# EAGLE schematic FioSaber Prototype C (EAGLE 6.5.0)
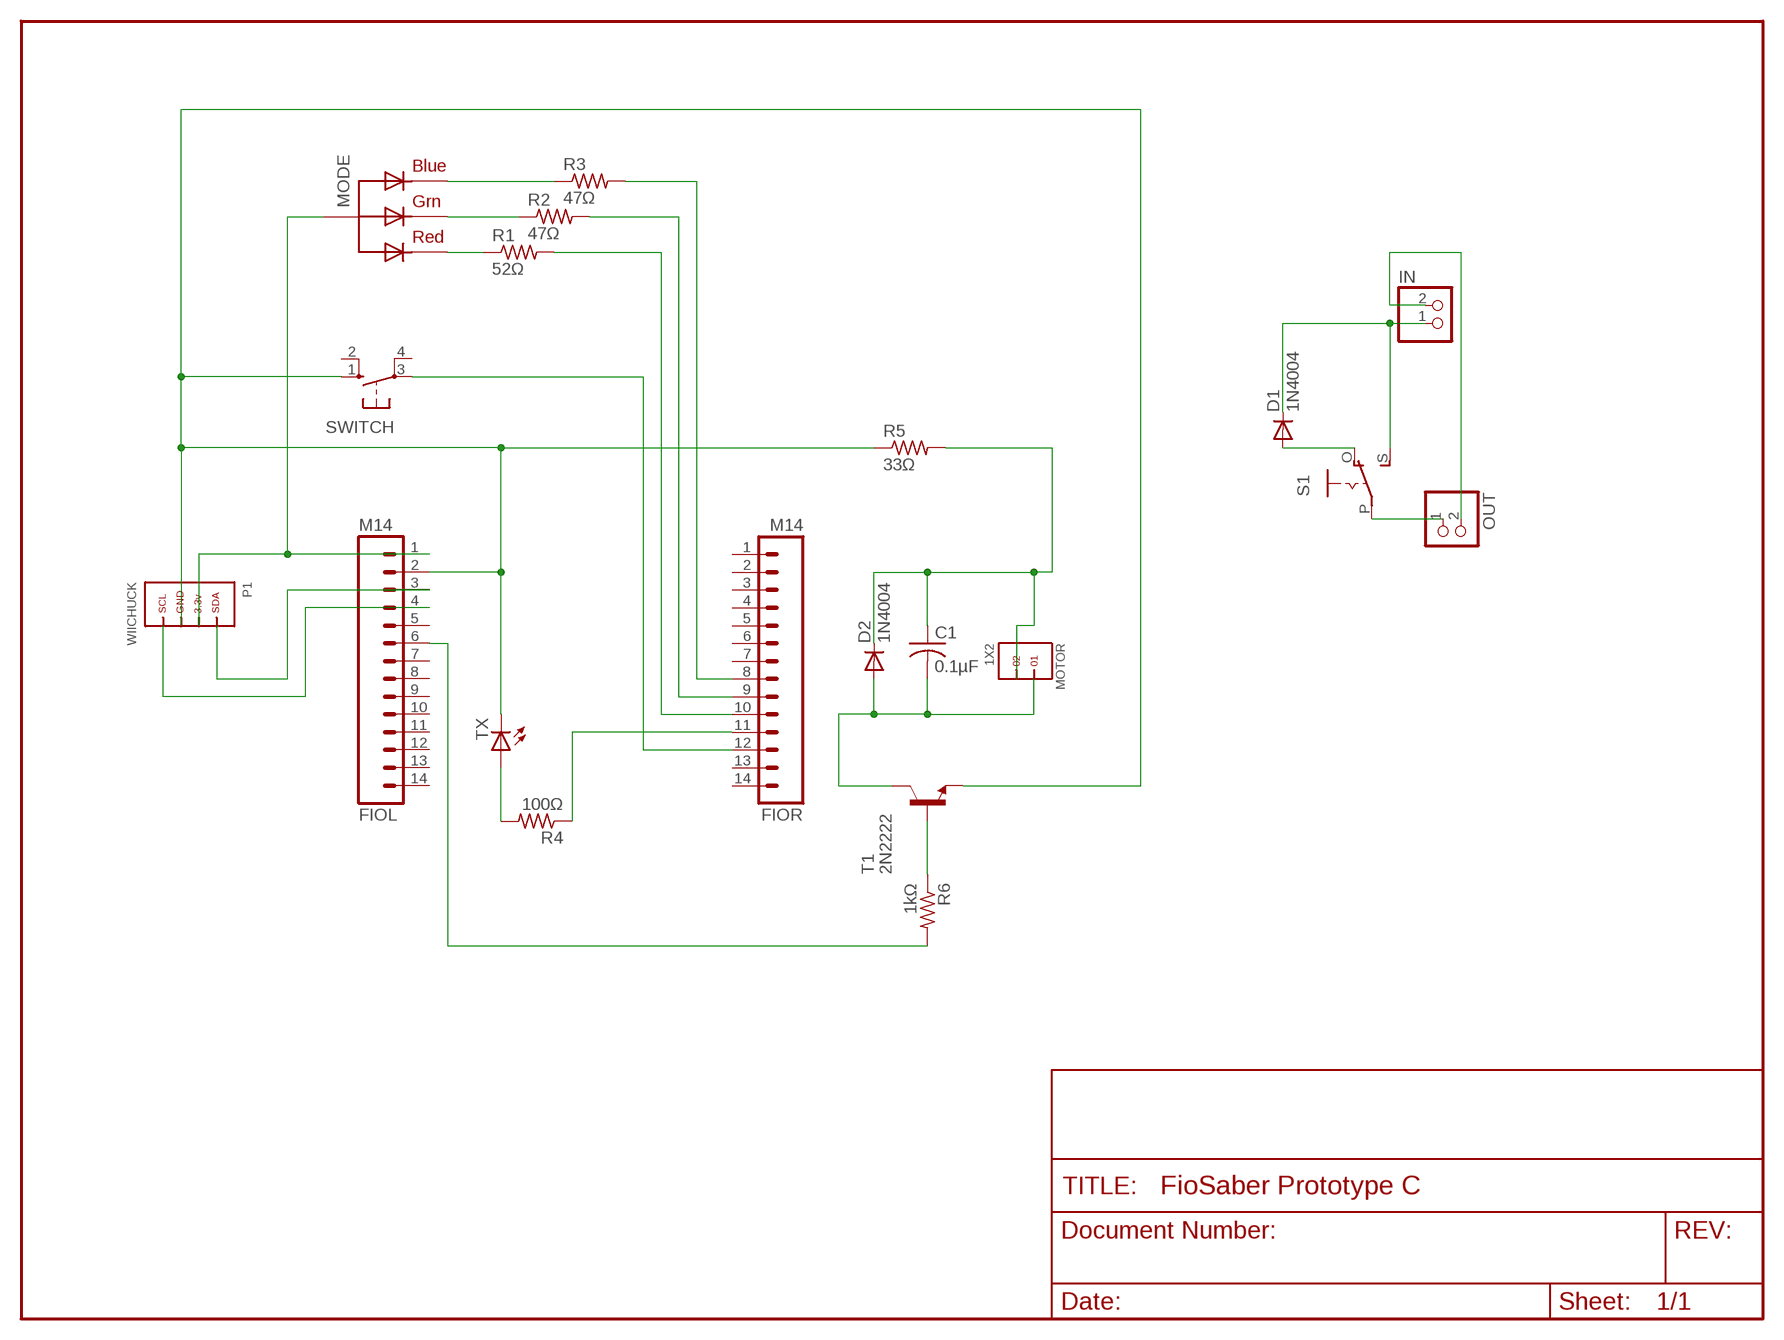
[diagram p0: schematic, sheet 1]

## Parts
C1  0.1µF  C-US025-025X050  [C025-025X050]
D1  1N4004  [DO41-10]
D2  1N4004  [DO41-10]
FIOL  M14  [1X14]
FIOR  M14  [1X14]
IN  JST_2PIN-THM-RA  [JST-PH-2-THM-RA]
MODE  RGBLED_CA-PIRANHA  [PIRANHA5MM]
MOTOR  1X2  [1X2]
OUT  JST_2PIN-THM-RA  [JST-PH-2-THM-RA]
P1  WIICHUCK  [MEMOREX_RECEIVER]
R1  52Ω  R-US_0207/7  [0207/7]
R2  47Ω  R-US_0207/7  [0207/7]
R3  47Ω  R-US_0207/7  [0207/7]
R4  100Ω  R-US_0207/7  [0207/7]
R5  33Ω  R-US_0207/7  [0207/7]
R6  1kΩ  R-US_0207/7  [0207/7]
S1  EG1218S  [EG1218]
SWITCH  10-XX  [B3F-10XX]
T1  2N2222  [TO92-EBC-OVAL]
TX  LED3MM  [LED3MM]

## Nets
N$1: FIOL.1 MODE.4(VCC) P1.SDA
N$2: D1.C IN.1 S1.S
N$3: FIOL.4 P1.GND
N$4: FIOL.3 P1.PWR
N$5: D1.A S1.O
N$6: MODE.2(RED) R1.1
N$7: FIOL.2 P1.SCL R5.1 SWITCH.1(S) T1.E TX.K(C)
N$8: MODE.3(GREEN) R2.1
N$9: MODE.1(BLUE) R3.1
N$10: OUT.1 S1.P
N$11: IN.2 OUT.2
N$12: FIOR.12 SWITCH.3(P)
N$13: FIOR.10 R1.2
N$14: FIOR.9 R2.2
N$15: FIOR.8 R3.2
N$16: FIOL.6 R6.2
N$17: FIOR.11 R4.1
N$18: R6.1 T1.B
N$19: C1.2 D2.A MOTOR.1 T1.C
N$20: C1.1 D2.C MOTOR.2 R5.2
N$25: R4.2 TX.A
Unconnected: FIOL.5 FIOL.7 FIOL.8 FIOL.9 FIOL.10 FIOL.11 FIOL.12 FIOL.13 FIOL.14 FIOR.1 FIOR.2 FIOR.3 FIOR.4 FIOR.5 FIOR.6 FIOR.7 FIOR.13 FIOR.14 SWITCH.2(S1) SWITCH.4(P1)

## Library data of the parts
C1 = rcl:C-US: CAPACITOR, American symbol
D1 D2 = adafruit:1N4004: DIODE General purpose 1N400x type rectifier (With bigger pads) http://www.ladyada.net/library/pcb/eaglelibrary.html
FIOL FIOR = SparkFun:M14: Header 14 Standard 14-pin 0.1" header. Use with straight break away headers (SKU : PRT-00116), right angle break away headers (PRT-00553), swiss pins (PRT-00743), machine pins (PRT-00117), and female headers (PRT-00115).
IN OUT = adafruit:JST_2PIN: JST 2-Pin Connectors of various flavors SMT-RA (S2B-PH-SM4) 4UConnector #17311 SMT (B2B-PH-SM4) THM-RA (S2B-PH) THM (B2B-PH)
MODE = adafruit:RGBLED_CA: RGB LED, common-anode 5MM Staggered pins 5mm Piranha package http://www.ladyada.net/library/pcb/eaglelibrary.html
MOTOR = headers(.1in):1X2
P1 = nintendo:WIICHUCK
R1-R6 = adafruit:R-US_: RESISTOR, American symbol
S1 = adafruit:EG1218: SLIDING SWITCH 0.1" spacing through hole, vertical SPDT slide switch http://www.ladyada.net/library/pcb/eaglelibrary.html
SWITCH = switch-omron:10-XX: OMRON SWITCH; MPN: B3F-1000; OC_FARNELL: 176432; OC_NEWARK: 36M3542
T1 = adafruit:2N2222: NPN TRANSISTOR Big oval pads
TX = adafruit:LED: LED OSRAM: - CHIPLED LG R971, LG N971, LY N971, LG Q971, LY Q971, LO R971, LY R971 LH N974, LH R974 LS Q976, LO Q976, LY Q976 LO Q996 - Hyper CHIPLED LW Q18S LB Q993, LB Q99A, LB R99A - SideLED LS A670, LO A670, LY A670, LG A670, LP A670 LB A673, LV A673, LT A673, LW A673 LH A674 LY A675 LS A676, LA A676, LO A676, LY A676, LW A676 LS A679, LY A679, LG A679 - Hyper Micro SIDELED® LS Y876, LA Y876, LO Y876, LY Y876 LT Y87S - SmartLED LW L88C, LW L88S LB L89C, LB L89S, LG L890 LS L89K, LO L89K, LY L89K LS L896, LA L896, LO L896, LY L896 - TOPLED LS T670, LO T670, LY T670, LG T670, LP T670 LSG T670, LSP T670, LSY T670, LOP T670, LYG T670 LG T671, LOG T671, LSG T671 LB T673, LV T673, LT T673, LW T673 LH T674 LS T676, LA T676, LO T676, LY T676, LB T676, LH T676, LSB T676, LW T676 LB T67C, LV T67C, LT T67C, LS T67K, LO T67K, LY T67K, LW E67C LS E67B, LA E67B, LO E67B, LY E67B, LB E67C, LV E67C, LT E67C LW T67C LS T679, LY T679, LG T679 LS T770, LO T770, LY T770, LG T770, LP T770 LB T773, LV T773, LT T773, LW T773 LH T774 LS E675, LA E675, LY E675, LS T675 LS T776, LA T776, LO T776, LY T776, LB T776 LHGB T686 LT T68C, LB T68C - Hyper Mini TOPLED® LB M676 - Mini TOPLED Santana® LG M470 LS M47K, LO M47K, LY M47K Source: http://www.osram.convergy.de/

## Net classes
0 Default: width 0.203 mm, clearance 0.205 mm
2 LEDPower: width 0.203 mm
3 ButtonSignal: width 0.203 mm